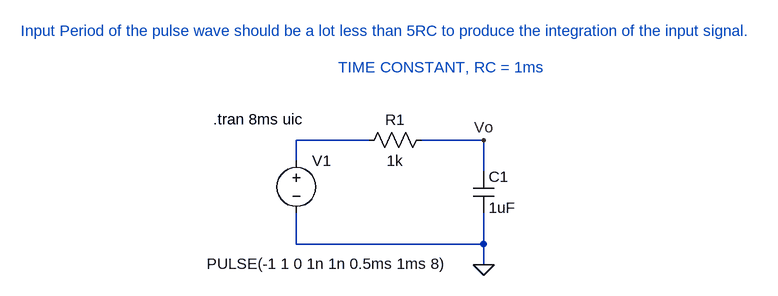
[diagram p0: schematic rc_integreator.asc]
rc_integreator.asc, the LTspice schematic file:
Version 4.1
SHEET 1 880 680
WIRE 96 80 -16 80
WIRE 272 80 176 80
WIRE -16 112 -16 80
WIRE 272 128 272 80
WIRE -16 240 -16 192
WIRE 272 240 272 192
WIRE 272 240 -16 240
WIRE 272 272 272 240
FLAG 272 272 0
FLAG 272 80 Vo
SYMBOL res 192 64 R90
WINDOW 0 0 56 VBottom 2
WINDOW 3 32 56 VTop 2
SYMATTR InstName R1
SYMATTR Value 1k
SYMBOL cap 256 128 R0
SYMATTR InstName C1
SYMATTR Value 1uF
SYMBOL voltage -16 96 R0
WINDOW 3 -138 174 Left 2
WINDOW 123 0 0 Left 0
WINDOW 39 0 0 Left 0
SYMATTR Value PULSE(-1 1 0 1n 1n 0.5ms 1ms 8)
SYMATTR InstName V1
TEXT -144 48 Left 2 !.tran 8ms uic
TEXT 48 -32 Left 2 ;TIME CONSTANT, RC = 1ms
TEXT -440 -88 Left 2 ;Input Period of the pulse wave should be a lot less than 5RC to produce the integration of the input signal.

The netlist it stands for:
* rc_integreator.asc
R1 Vo N001 1k
C1 Vo 0 1uF
V1 N001 0 PULSE(-1 1 0 1n 1n 0.5ms 1ms 8)
.tran 8ms uic
* TIME CONSTANT, RC = 1ms
* Input Period of the pulse wave should be a lot less than 5RC to produce the integration of the input signal.
.backanno
.end